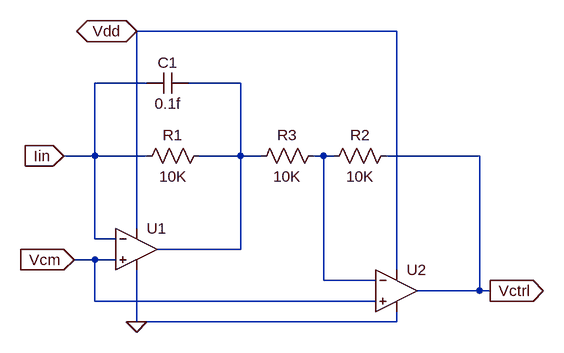
[diagram p0: schematic tia_sch_v0.asc]
tia_sch_v0.asc, the LTspice schematic file:
Version 4
SHEET 1 880 680
WIRE 320 -208 -80 -208
WIRE -64 -128 -144 -128
WIRE 80 -128 0 -128
WIRE -144 -16 -144 -128
WIRE -144 -16 -192 -16
WIRE -64 -16 -144 -16
WIRE 80 -16 80 -128
WIRE 80 -16 16 -16
WIRE 112 -16 80 -16
WIRE 208 -16 192 -16
WIRE 224 -16 208 -16
WIRE 448 -16 304 -16
WIRE -80 96 -80 -208
WIRE -144 112 -144 -16
WIRE -112 112 -144 112
WIRE 80 128 80 -16
WIRE 80 128 -48 128
WIRE -144 144 -176 144
WIRE -112 144 -144 144
WIRE 320 160 320 -208
WIRE 208 176 208 -16
WIRE 288 176 208 176
WIRE 448 192 448 -16
WIRE 448 192 352 192
WIRE 464 192 448 192
WIRE -144 208 -144 144
WIRE 288 208 -144 208
WIRE -80 240 -80 160
WIRE 320 240 320 224
WIRE 320 240 -80 240
FLAG -176 144 Vcm
IOPIN -176 144 In
FLAG 464 192 Vctrl
IOPIN 464 192 Out
FLAG -192 -16 Iin
IOPIN -192 -16 In
FLAG -80 -208 Vdd
IOPIN -80 -208 BiDir
FLAG -80 240 0
SYMBOL OpAmps\\UniversalOpAmp -80 128 R0
SYMATTR InstName U1
SYMATTR Value2 Avol=1Meg GBW=800Meg Vos=0 Slew=80Meg
SYMBOL OpAmps\\UniversalOpAmp 320 192 R0
SYMATTR InstName U2
SYMATTR Value2 Avol=1Meg GBW=800Meg Vos=0 Slew=80Meg
SYMBOL res 32 -32 R90
WINDOW 0 0 56 VBottom 2
WINDOW 3 32 56 VTop 2
SYMATTR InstName R1
SYMATTR Value 10K
SYMBOL cap 0 -144 R90
WINDOW 0 0 32 VBottom 2
WINDOW 3 32 32 VTop 2
SYMATTR InstName C1
SYMATTR Value 0.1f
SYMBOL res 320 -32 R90
WINDOW 0 0 56 VBottom 2
WINDOW 3 32 56 VTop 2
SYMATTR InstName R2
SYMATTR Value 10K
SYMBOL res 208 -32 R90
WINDOW 0 0 56 VBottom 2
WINDOW 3 32 56 VTop 2
SYMATTR InstName R3
SYMATTR Value 10K

The netlist it stands for:
* tia_sch_v0.asc
XU1 Vcm Iin Vdd 0 N001 level1 Avol=1Meg GBW=800Meg Vos=0 Slew=80Meg En=0 Enk=0 In=0 Ink=0 Rin=500Meg  ; pins In+ In- V+ V- OUT
XU2 Vcm N002 Vdd 0 Vctrl level1 Avol=1Meg GBW=800Meg Vos=0 Slew=80Meg En=0 Enk=0 In=0 Ink=0 Rin=500Meg  ; pins In+ In- V+ V- OUT
R1 N001 Iin 10K
C1 N001 Iin 0.1f
R2 Vctrl N002 10K
R3 N002 N001 10K
.lib UniversalOpAmp1.lib
.backanno
.end